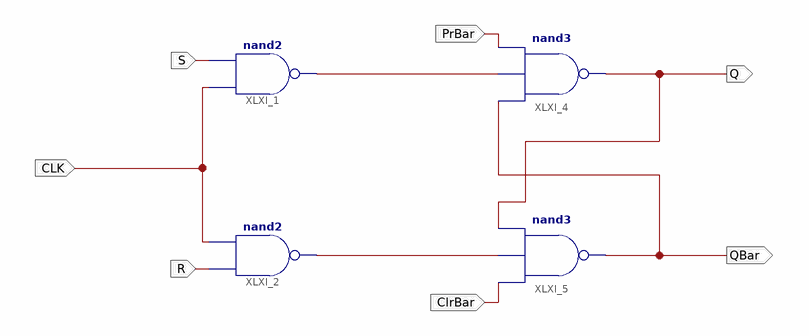
[diagram p0: schematic sheet 1]
// Xilinx ISE schematic Clocked_Nand_Latch.sch (spartan3e) as structural Verilog: 4 symbols, 7 ports
module Clocked_Nand_Latch (
  input  S,
  input  R,
  input  CLK,
  input  PrBar,
  input  ClrBar,
  output QBar,
  output Q
);

  wire XLXN_13, XLXN_14;

  nand XLXI_1 (XLXN_13, CLK, S);
  nand XLXI_2 (XLXN_14, R, CLK);
  nand XLXI_4 (Q, QBar, XLXN_13, PrBar);
  nand XLXI_5 (QBar, ClrBar, XLXN_14, Q);
endmodule
